# Altium schematic sheet ui_debug.SchDoc: mcHF Pro Transceiver UI board
size A3; Author: Krassi Atanassov; CompanyName: MØNKA; Engineer: For radio amateurs experimentation, non-commercial use only. Thank you!; Revision: 0.8.2; SheetTotal: 18
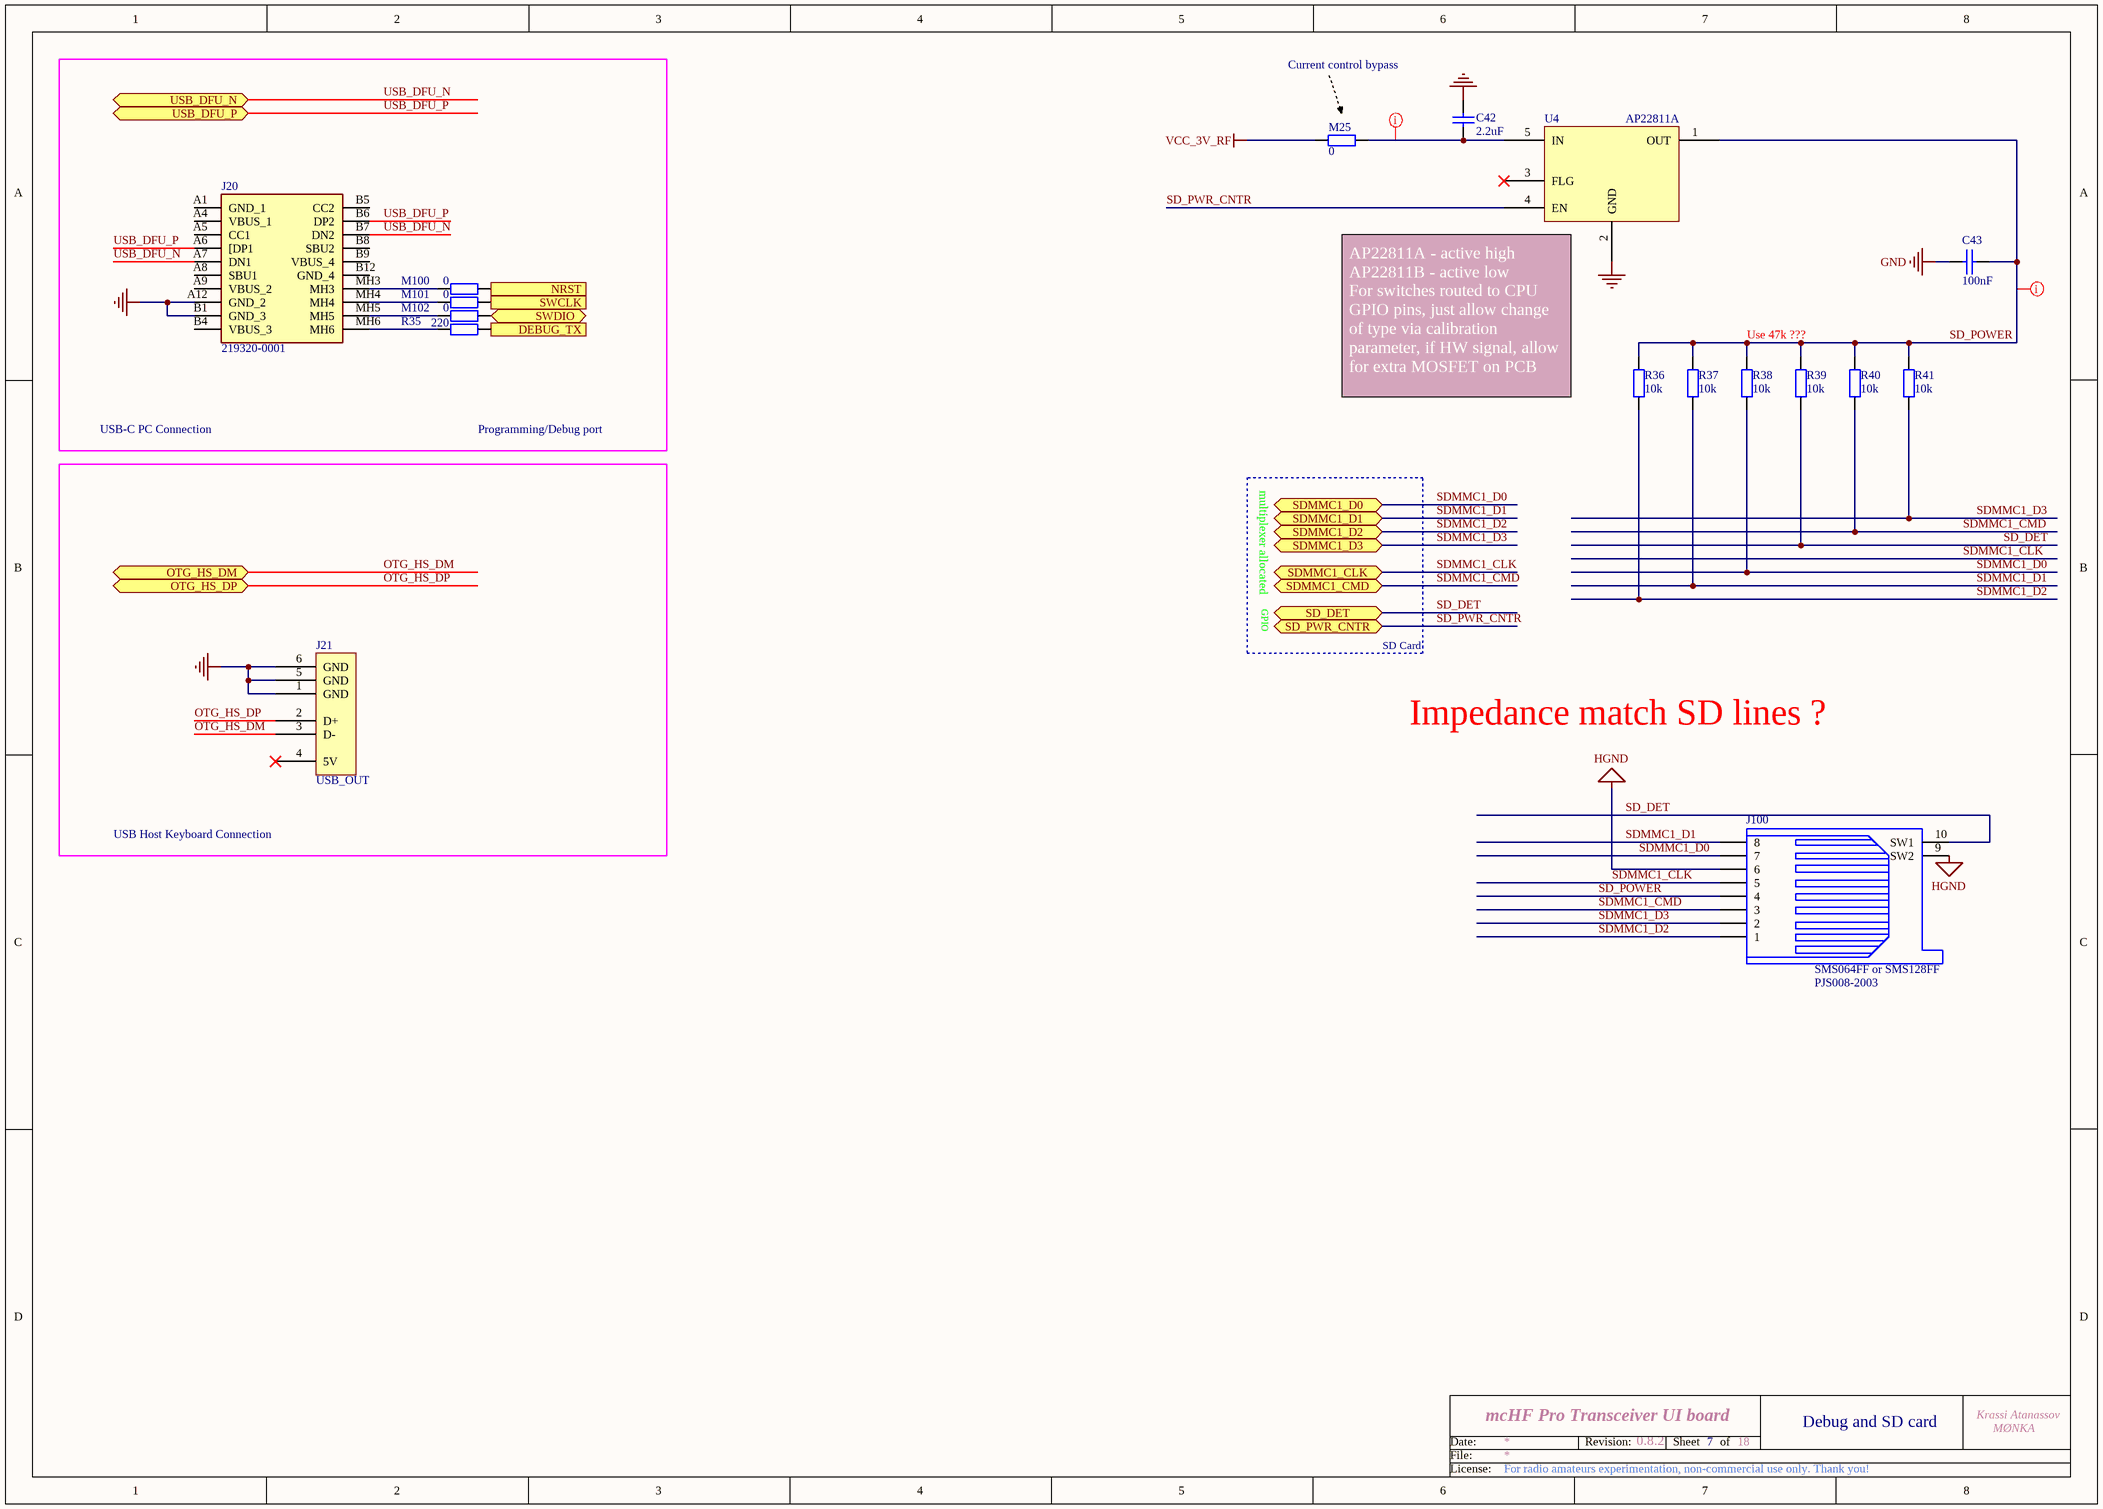
[diagram p0: ui_debug.SchDoc]

## Parts
C42  2.2uF  [0805]
C43  100nF  [0805]
J20  219320-0001  [2193200001]
J21  USB_OUT  [USB_OUT_A]
J100  PJS008-2003  [PJS008-2003-1]
M25  0  [0805]
M100  0  [0805]
M101  0  [0805]
M102  0  [0805]
R35  220  [0805]
R36  10k  [0805]
R37  10k  [0805]
R38  10k  [0805]
R39  10k  [0805]
R40  10k  [0805]
R41  10k  [0805]
U4  AP22811A  [SOT25-5]

## Blocks framed on the sheet
USB Host Keyboard Connection: J21

## Ports
DEBUG_TX (in), NRST (out), OTG_HS_DM (bidir), OTG_HS_DP (bidir), SD_DET (bidir), SD_PWR_CNTR (bidir), SDMMC1_CLK (bidir), SDMMC1_CMD (bidir), SDMMC1_D0 (bidir), SDMMC1_D1 (bidir), SDMMC1_D2 (bidir), SDMMC1_D3 (bidir), SWCLK (in), SWDIO (bidir), USB_DFU_N (bidir), USB_DFU_P (bidir)

## Nets
GND: C42.1 C43.2 J20.A12(GND_2) J20.B1(GND_3) J21.1(GND) J21.5(GND) J21.6(GND) U4.2(GND)
HGND: J100.6 J100.9(SW2)
VCC_3V_RF: M25.1
DEBUG_TX: R35.1 ; port DEBUG_TX
NRST: M100.2 ; port NRST
OTG_HS_DM: J21.3(D-) ; port OTG_HS_DM
OTG_HS_DP: J21.2(D+) ; port OTG_HS_DP
SD_DET: J100.10(SW1) R39.2 ; port SD_DET
SD_POWER: C43.1 J100.4 R36.1 R37.1 R38.1 R39.1 R40.1 R41.1 U4.1(OUT)
SD_PWR_CNTR: U4.4(EN) ; port SD_PWR_CNTR
SDMMC1_CLK: J100.5 ; port SDMMC1_CLK
SDMMC1_CMD: J100.3 R40.2 ; port SDMMC1_CMD
SDMMC1_D0: J100.7 R38.2 ; port SDMMC1_D0
SDMMC1_D1: J100.8 R37.2 ; port SDMMC1_D1
SDMMC1_D2: J100.1 R36.2 ; port SDMMC1_D2
SDMMC1_D3: J100.2 R41.2 ; port SDMMC1_D3
SWCLK: M101.2 ; port SWCLK
SWDIO: M102.2 ; port SWDIO
USB_DFU_N: J20.A7(DN1) J20.B7(DN2) ; port USB_DFU_N
USB_DFU_P: J20.A6([DP1) J20.B6(DP2) ; port USB_DFU_P
NetC42_2: C42.2 M25.2 U4.5(IN)
NetJ20_MH3: J20.MH3 M100.1
NetJ20_MH4: J20.MH4 M101.1
NetJ20_MH5: J20.MH5 M102.1
NetJ20_MH6: J20.MH6 R35.2

Not connected (* = marked no-connect by the designer): J20 A1(GND_1) A4(VBUS_1) A5(CC1) A8(SBU1) A9(VBUS_2) B4(VBUS_3) B5(CC2) B8(SBU2) B9(VBUS_4) B12(GND_4); J21 4(5V)*; U4 3(FLG)*

## Layout directives
rule Width Constraint [Pref Width = 12mil    Min Width = 12mil    Max Width = 12mil]: NetC42_2, SD_POWER

## Notes on the sheet
- Current control bypass
- Use 47k ???
- USB-C PC Connection
- Programming/Debug port
- (near U4) AP22811A - active high                                 AP22811B - active low                             For switches routed to CPU GPIO pins, just allow change of type via calibration parameter, if HW signal, allow for extra MOSFET on PCB
- multiplexer allocated
- GPIO
- SD Card
- Impedance match SD lines ?
- (near J100) SMS064FF or SMS128FF
- 7
- Debug and SD card
- Date:
- File:
- Revision:
- Sheet
- of
- License:

## Library data of the parts
C42 = CAP SMD 0603  X5R 1礔 25V 10%: 0603  X5R 1礔; Rated voltage: 25V; Tolerance: 10%; Manufacturer: *; Manufacturer P/N: *; Order code Farnell: 1288202RL; Value: 1礔; Power: *; Technology: X5R; Temperature  Factor: *; Temperature Max: +125癈; Temperature Min: -55癈; STS Code: *
C43 = CAP: Capacitor; Order: FN 282-1264; QT Order: QCC-00157; Price: 0.089
J20 = 219320-0001: Universal Serial Bus (USB) Shielded I/O Receptacle, Type C, Vertical, Surface Mount, Height 8.8mm, 16 Circuits, Gold (Au) Flash Plating; Manufacturer_Name: Molex; Geometry.Height: 9.05mm; Mouser Part Number: 538-219320-0001; Mouser Price/Stock: https://www.mouser.co.uk/ProductDetail/Molex/219320-0001?qs=rQFj71Wb1eXha8qVBIXu3A%3D%3D; Manufacturer_Part_Number: 219320-0001; Datasheet Link: https://www.molex.com/content/dam/molex/molex-dot-com/products/automated/en-us/salesdrawingpdf/219/219320/2193200001_sd.pdf?inline
J21 = USB_OUT: USB Host Connector
J100 = microSD-PJS008-2003: Memory Card Connectors MicroSD Card Conn Revrs Mnt Push-Push; Manuf_1: YAMAICHI; Notes: need to find on Ali!; Manuf_Part_1: PJS008-2003-1; Distrib: *; Order: PJS008-2003-1; ECCN_US/EU: n/a
M25 M100-M102 = RES: Resistor; Order: FN 933-3681; QT Order: QCR-00268; Price: 0.009
R35 = RES: Resistor; Order: FN 146-9899; QT Order: QCR-00309; Price: 0.023
R36 = RES: Resistor; Order: FN 146-9857; QT Order: QCR-00349; QT Price: 0.03; Price: 0.046
R37-R41 = RES: Resistor; Order: FN 146-9857; Price: 0.046
U4 = AP22811: High-side switch; Order: FN 274-8550